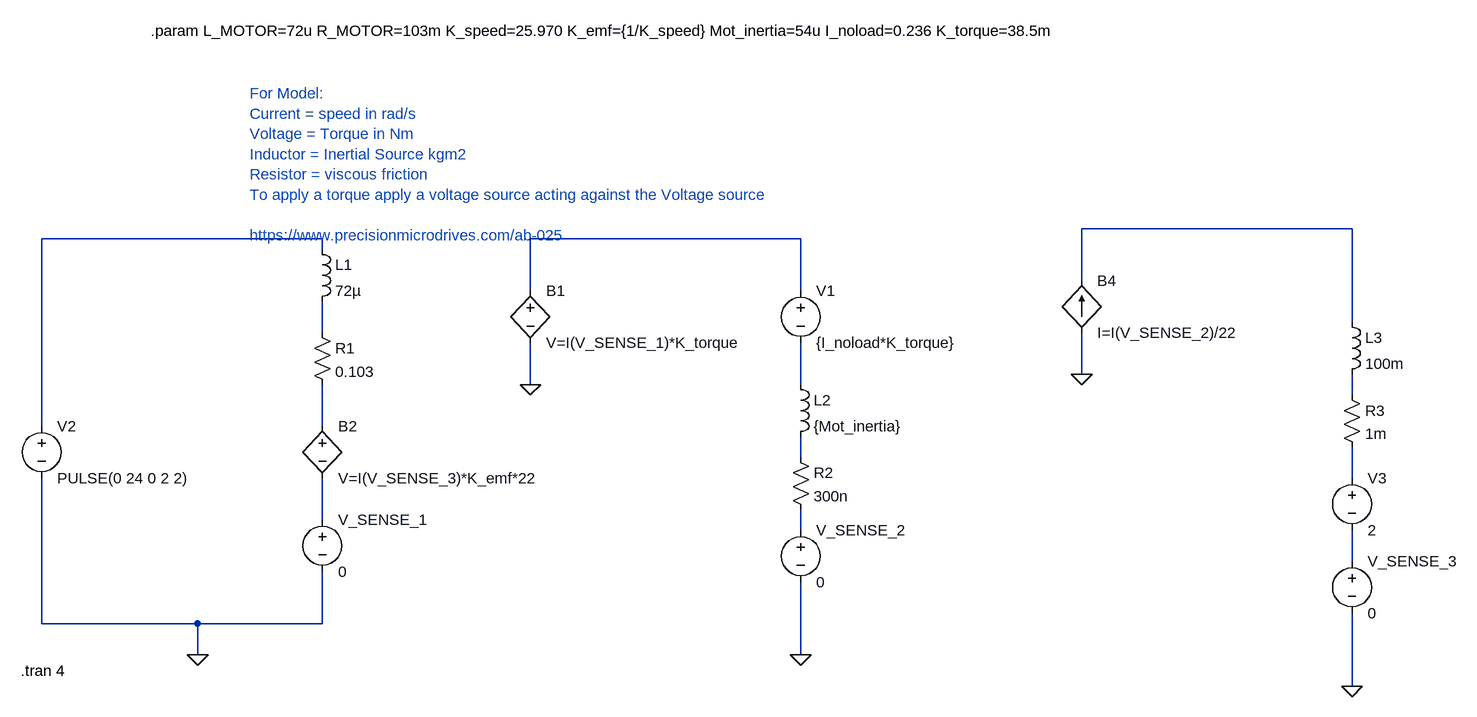
[diagram p0: schematic MotorTest.asc]
MotorTest.asc, the LTspice schematic file:
Version 4.1
SHEET 1 2120 756
WIRE 1808 32 1392 32
WIRE 224 48 -208 48
WIRE 960 48 544 48
WIRE 224 64 224 48
WIRE 1392 112 1392 32
WIRE 544 128 544 48
WIRE 960 128 960 48
WIRE 1808 176 1808 32
WIRE 224 192 224 144
WIRE 1392 256 1392 192
WIRE 544 272 544 208
WIRE 960 272 960 208
WIRE 1808 288 1808 256
WIRE -208 336 -208 48
WIRE 224 336 224 272
WIRE 960 384 960 352
WIRE 1808 416 1808 368
WIRE 224 480 224 416
WIRE 960 496 960 464
WIRE 1808 544 1808 496
WIRE -208 640 -208 416
WIRE 32 640 -208 640
WIRE 224 640 224 560
WIRE 224 640 32 640
WIRE 32 688 32 640
WIRE 960 688 960 576
WIRE 1808 736 1808 624
FLAG 32 688 0
FLAG 960 688 0
FLAG 544 272 0
FLAG 1808 736 0
FLAG 1392 256 0
SYMBOL ind 208 48 R0
SYMATTR InstName L1
SYMATTR Value 72µ
SYMBOL res 208 176 R0
SYMATTR InstName R1
SYMATTR Value 0.103
SYMBOL voltage 224 464 R0
WINDOW 123 0 0 Left 0
WINDOW 39 0 0 Left 0
SYMATTR InstName V_SENSE_1
SYMATTR Value 0
SYMBOL voltage -208 320 R0
WINDOW 123 0 0 Left 0
WINDOW 39 0 0 Left 0
SYMATTR InstName V2
SYMATTR Value PULSE(0 24 0 2 2)
SYMBOL voltage 960 480 R0
WINDOW 123 0 0 Left 0
WINDOW 39 0 0 Left 0
SYMATTR InstName V_SENSE_2
SYMATTR Value 0
SYMBOL ind 944 256 R0
SYMATTR InstName L2
SYMATTR Value {Mot_inertia}
SYMATTR SpiceLine Rser=0
SYMBOL voltage 960 112 R0
WINDOW 123 0 0 Left 0
WINDOW 39 0 0 Left 0
SYMATTR InstName V1
SYMATTR Value {I_noload*K_torque}
SYMBOL bv 544 112 R0
SYMATTR InstName B1
SYMATTR Value V=I(V_SENSE_1)*K_torque
SYMBOL bv 224 320 R0
SYMATTR InstName B2
SYMATTR Value V=I(V_SENSE_3)*K_emf*22
SYMBOL res 944 368 R0
SYMATTR InstName R2
SYMATTR Value 300n
SYMBOL voltage 1808 528 R0
WINDOW 123 0 0 Left 0
WINDOW 39 0 0 Left 0
SYMATTR InstName V_SENSE_3
SYMATTR Value 0
SYMBOL ind 1792 160 R0
SYMATTR InstName L3
SYMATTR Value 100m
SYMATTR SpiceLine Rser=0
SYMBOL voltage 1808 400 R0
WINDOW 123 0 0 Left 0
WINDOW 39 0 0 Left 0
SYMATTR InstName V3
SYMATTR Value 2
SYMBOL res 1792 272 R0
SYMATTR InstName R3
SYMATTR Value 1m
SYMBOL bi2 1392 112 R0
SYMATTR InstName B4
SYMATTR Value I=I(V_SENSE_2)/22
TEXT -240 712 Left 2 !.tran 4
TEXT 112 -176 Left 2 ;For Model:\nCurrent = speed in rad/s\nVoltage = Torque in Nm\nInductor = Inertial Source kgm2\nResistor = viscous friction \nTo apply a torque apply a voltage source acting against the Voltage source\n \nhttps://www.precisionmicrodrives.com/ab-025
TEXT -40 -272 Left 2 !.param L_MOTOR=72u R_MOTOR=103m K_speed=25.970 K_emf={1/K_speed} Mot_inertia=54u I_noload=0.236 K_torque=38.5m

The netlist it stands for:
* MotorTest.asc
L1 N002 N004 72µ
R1 N004 N007 0.103
V_SENSE_1 N010 0 0
V2 N002 0 PULSE(0 24 0 2 2)
V_SENSE_2 N011 0 0
L2 N005 N008 {Mot_inertia} Rser=0
V1 N003 N005 {I_noload*K_torque}
B1 N003 0 V=I(V_SENSE_1)*K_torque
B2 N007 N010 V=I(V_SENSE_3)*K_emf*22
R2 N008 N011 300n
V_SENSE_3 N012 0 0
L3 N001 N006 100m Rser=0
V3 N009 N012 2
R3 N006 N009 1m
B4 0 N001 I=I(V_SENSE_2)/22
.tran 4
* For Model:
* Current = speed in rad/s
* Voltage = Torque in Nm
* Inductor = Inertial Source kgm2
* Resistor = viscous friction
* To apply a torque apply a voltage source acting against the Voltage source
* https://www.precisionmicrodrives.com/ab-025
.param L_MOTOR=72u R_MOTOR=103m K_speed=25.970 K_emf={1/K_speed} Mot_inertia=54u I_noload=0.236 K_torque=38.5m
.backanno
.end